# EAGLE design Falhaber DC CONN (EAGLE 9.6.2)
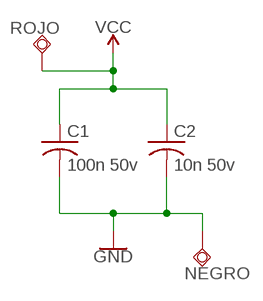
[diagram p0: schematic, sheet 1]

## Parts
C1  100n 50v  C-USC0805  [C0805]
C2  10n 50v  C-USC0805  [C0805]
NEGRO  TESTPAD_TPSQTP10SQ  [TESTPAD_TP10SQ]
ROJO  TESTPAD_TPSQTP10SQ  [TESTPAD_TP10SQ]

## Nets
GND: C1.2 C2.2 NEGRO.TP
VCC: C1.1 C2.1 ROJO.TP

## Library data of the parts
C1 C2 = adafruit:C-US: CAPACITOR, American symbol
NEGRO ROJO = BeagleBone_Blue_R3:TESTPAD_TPSQ: Test pad

## Board
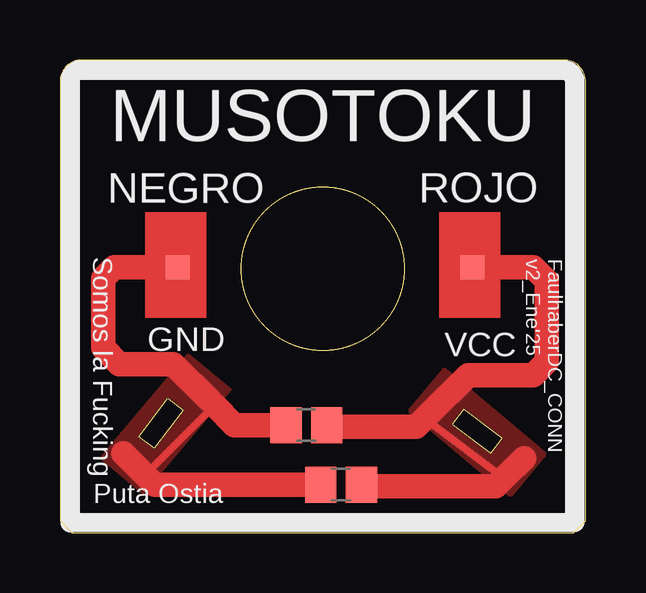
[diagram p1: board, top side]
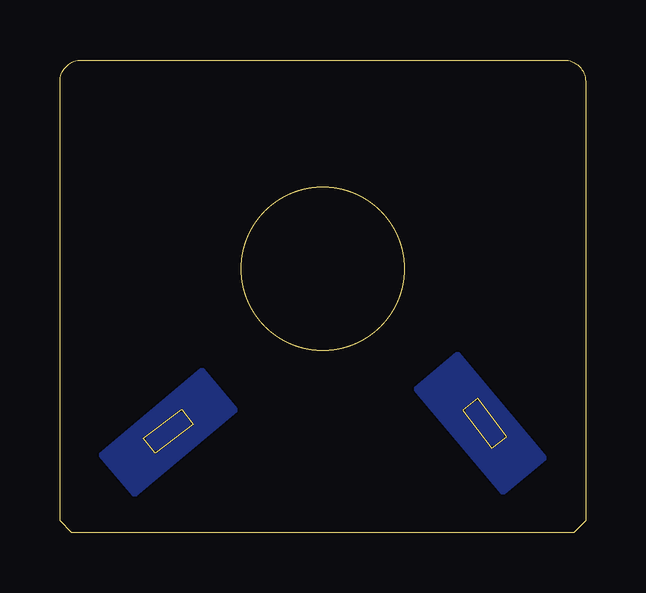
[diagram p2: board, bottom side, seen from below]

Size 21.9 x 19.7 mm. Coordinates in mm from the lower left corner, seen from the top.
Outline: 16.83,5.15 16.35,4.51 17.94,3.3 18.42,3.94 16.83,5.15
Outline: 5.13,5.11 3.92,3.52 3.28,4 4.49,5.6 5.13,5.11
Outline: 21.9,18.8 arc90 21,19.7 0.9,19.7 arc90 0,18.8 0,0.5 0.5,0 21.4,0 21.9,0.5 21.9,18.8
Outline: circle at 10.94,10.99 radius 3.4
Copper layers (1*16): Top 0.035mm / dielectric 1.5mm / Bottom 0.035mm
Design rules "default *": minimum track width 6mil, minimum drill 0.35mm, track to track 6mil, track to pad 6mil, pad to pad 6mil, via to via 6mil, smd to smd 0mil, copper to edge 1mil, drill to drill 6mil, minimum pad ring 10mil, minimum via ring 8mil, stop-mask expansion 4mil, vias tented up to drill 0mil, thermal gap 10mil

### Footprints (pad centres in the part's own frame; a part is rotated, then mirrored left to right if it is on the bottom)
C0805 = smd 1.3 x 1.5: 1 -0.85,0; 2 0.85,0
TESTPAD_TP10SQ = smd 1 x 1: TP 0,0

### Placement (x,y rotation side)
C1  10.26,4.49 180 top
C2  11.71,2.01 180 top
NEGRO  4.9,11.07 0 top
ROJO  17.18,11.07 0 top

### Tracks (layer width: path | path; a pad name or v marks a point on that pad's centre or on a via)
GND
  Top 0.305: 3.57,2.38 3.57,2.45 6.44,5.31
  Top 1.016: C1.2 7.26,4.49 6.44,5.31 | C2.2 3.94,2.01 3.57,2.38 2.64,3.31 | NEGRO.TP 2.26,11.07 1.79,10.6 1.79,7.71 2.47,7.03 4.72,7.03 6.25,5.5
  pour Top: 5.33,7.45 1.71,3.13 3.48,1.64 7.1,5.96
  pour Bottom: 5.34,7.46 1.7,3.12 3.43,1.66 7.08,6
VCC
  Top 0.203: 18.36,2.37 18.6,2.37
  Top 0.305: 15.38,4.95 15.43,4.59 18.36,2.37
  Top 1.016: C1.1 11.18,4.42 14.85,4.42 15.38,4.95 17,6.57 19.71,6.57 20.27,7.13 20.27,10.5 19.71,11.07 ROJO.TP | C2.1 12.64,1.93 18.16,1.93 18.6,2.37 19.34,3.11
  pour Top: 20.19,3.27 16,6.78 14.59,5.09 18.77,1.58
  pour Bottom: 20.2,3.26 15.99,6.79 14.58,5.1 18.78,1.58
(copper drawn outside any net)
  shapes: Top area x2

### Text on the board
tPlace: MUSOTOKU | FaulhaberDC_CONN / v2_Ene'25 | GND | VCC | Somos la Fucking | Puta Ostia